# EAGLE design dpi rpi (EAGLE 8.3.2)
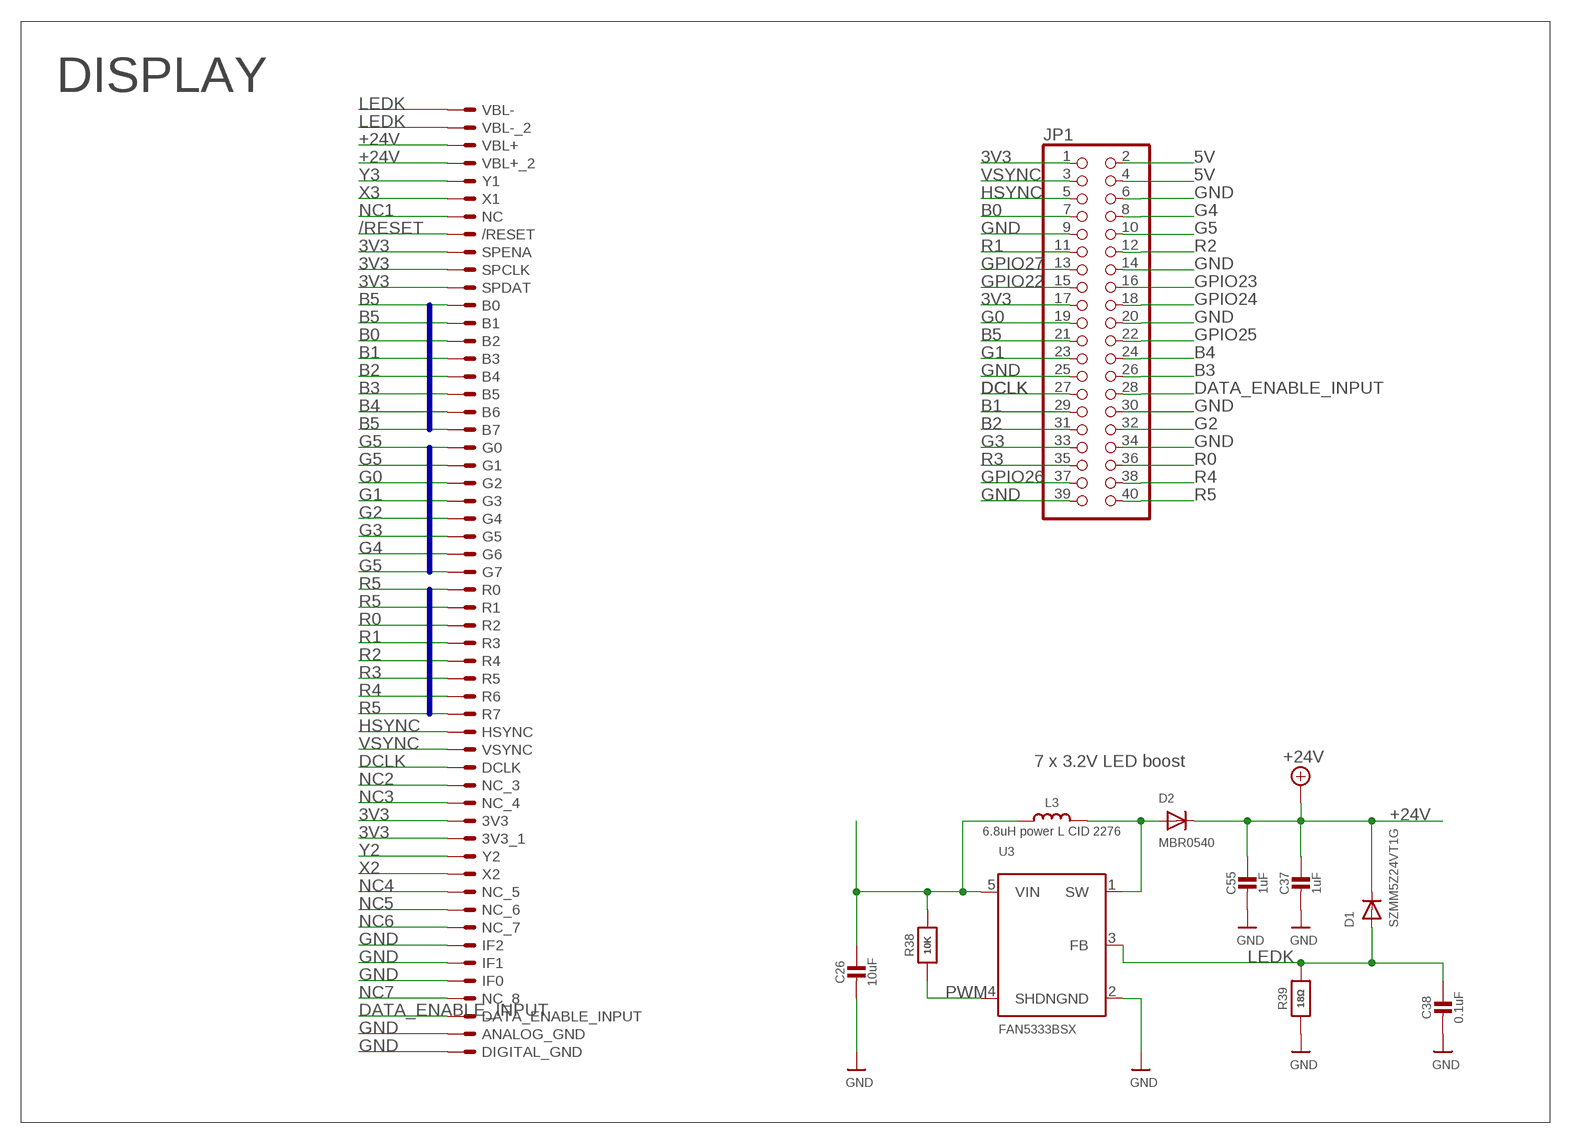
[diagram p0: schematic, sheet 1]

## Parts
C26  10uF  CAP_CERAMIC_0805MP  [_0805MP]
C37  1uF  CAP_CERAMIC_0805MP  [_0805MP]
C38  0.1uF  CAP_CERAMIC_0805MP  [_0805MP]
C55  1uF  CAP_CERAMIC_0805MP  [_0805MP]
D1  SZMM5Z24VT1G  DIODESMA  [SMADIODE]
D2  MBR0540  DIODESOD-123  [SOD-123]
JP1  PINHD-2X20  [2X20]
L3  6.8uH power L CID 2276  INDUCTORNR5040  [INDUCTOR_5X5MM_NR5040_NOTHERMALS]
R38  10K  RESISTOR_0805MP  [_0805MP]
R39  18Ω  RESISTOR_0805MP  [_0805MP]
U3  FAN5333BSX  FAN5331  [SOT23-5@1]
U$5  51296-5494  [51296]

## Nets
3V3: C26.1 JP1.1 JP1.17 L3.P$1 R38.2 U3.5(VIN) U$5.9(SPENA) U$5.10(SPCLK) U$5.11(SPDAT) U$5.41(3V3) U$5.42(3V3_1)
5V: JP1.2 JP1.4
+24V: C37.1 C55.1 D1.C D2.C U$5.3(VBL+) U$5.4(VBL+_2)
/RESET: U$5.8(/RESET)
B0: JP1.7 U$5.14(B2)
B1: JP1.29 U$5.15(B3)
B2: JP1.31 U$5.16(B4)
B3: JP1.26 U$5.17(B5)
B4: JP1.24 U$5.18(B6)
B5: JP1.21 U$5.12(B0) U$5.13(B1) U$5.19(B7)
DATA_ENABLE_INPUT: JP1.28 U$5.52(DATA_ENABLE_INPUT)
DCLK: JP1.27 U$5.38(DCLK)
G0: JP1.19 U$5.22(G2)
G1: JP1.23 U$5.23(G3)
G2: JP1.32 U$5.24(G4)
G3: JP1.33 U$5.25(G5)
G4: JP1.8 U$5.26(G6)
G5: JP1.10 U$5.20(G0) U$5.21(G1) U$5.27(G7)
GND: C26.2 C37.2 C38.2 C55.2 JP1.6 JP1.9 JP1.14 JP1.20 JP1.25 JP1.30 JP1.34 JP1.39 R39.1 U3.2(GND) U$5.48(IF2) U$5.49(IF1) U$5.50(IF0) U$5.53(ANALOG_GND) U$5.54(DIGITAL_GND)
GPIO22: JP1.15
GPIO23: JP1.16
GPIO24: JP1.18
GPIO25: JP1.22
GPIO26: JP1.37
GPIO27: JP1.13
HSYNC: JP1.5 U$5.36(HSYNC)
LEDK: C38.1 D1.A R39.2 U3.3(FB) U$5.1(VBL-) U$5.2(VBL-_2)
N$12: D2.A L3.P$2 U3.1(SW)
NC1: U$5.7(NC)
NC2: U$5.39(NC_3)
NC3: U$5.40(NC_4)
NC4: U$5.45(NC_5)
NC5: U$5.46(NC_6)
NC6: U$5.47(NC_7)
NC7: U$5.51(NC_8)
PWM: R38.1 U3.4(SHDN)
R0: JP1.36 U$5.30(R2)
R1: JP1.11 U$5.31(R3)
R2: JP1.12 U$5.32(R4)
R3: JP1.35 U$5.33(R5)
R4: JP1.38 U$5.34(R6)
R5: JP1.40 U$5.28(R0) U$5.29(R1) U$5.35(R7)
VSYNC: JP1.3 U$5.37(VSYNC)
X2: U$5.44(X2)
X3: U$5.6(X1)
Y2: U$5.43(Y2)
Y3: U$5.5(Y1)

## Buses
B0-B7
G0-G7
R0-R7

## Notes on the sheet
- DISPLAY
- 7 x 3.2V LED boost

## Library data of the parts
C26 C37 C38 C55 = microbuilder:CAP_CERAMIC: Ceramic Capacitors For new designs, use the packages preceded by an '_' character since they are more reliable: The following footprints should be used on most boards: _0402 - Standard footprint for regular board layouts _0603 - Standard footprint for regular board layouts _0805 - Standard footprint for regular board layouts _1206 - Standard footprint for regular board layouts For extremely tight-pitch boards where space is at a premium, the following 'micro-pitch' footprints can be used (smaller pads, no silkscreen outline, etc.): _0402MP - Micro-pitch footprint for very dense/compact boards _0603MP - Micro-pitch footprint for very dense/compact boards _0805MP - Micro-pitch footprint for very dense/compact boards _1206MP - Micro-pitch footprint for very dense/compact boards
D1 D2 = microbuilder:DIODE: Diode SMA Model Volts Amps Type Vf Vr Digikey # Notes SSA34-E3 40V 3A Schottky 480mV @ 3A 200uA @ 40V SSA34-E3/61TGITR-ND CDBA120-G 20V 1A Schottky 500mV @ 1A 500uA @ 20V 641-1014-6-ND REEL MBRA210 10V 2A Schottky 350mV @ 2A 700uA @ 10V MBRA210LT3 SOD-123 Model Volts Amps Type Vf Vr Order # Notes BAT54T1G 30V 200mA Schottky 800mV @ 200mA 2uA @ 25V BAT54T1GOSTR-ND B0530W 30V 500mA Schottky 430mV @ 500mA 130uA @ 30V B0530W-FDICT-ND REEL MBR120 20V 1A Schottky 340mV @ 1A MBR120VLSFT1GOSCT-ND SOD-323 Model Volts Amps Type Vf Vr Order # Notes PMEG2005EJ 20V 500mA Schottky 355mV @ 500mA 568-4110-1-ND ZLLS410 10V 570mA Schottky 380mV @ 570mA ZLLS410CT-ND 1N4148WS 75V 150mA Silicon/Simple 1V 1N4148WSFSCT-ND REEL SOD-523 Model Volts Amps Type Vf Vr Order # Notes BAT54XV2 30V 200mA Schottky 0.8V @ 100mA BAT54XV2CT-ND TB751S 30V 30mA Schottky RB751S-40TE61CT-ND SOT23-R/W (R = Solder Paste/Reflow Ovens, W = Hand-Soldering) Model Volts Amps Type Vf Vr Order # Notes BAT54FILM 40V 300mA Schottky 497-7162-1-ND
JP1 = adafruit:PINHD-2X20: PIN HEADER
L3 = microbuilder:INDUCTOR: Inductors 0603: 10nH Ceramic Inductor - microwire antenna/RF (Digikey: 712-1434-2-ND) 0805: 560nH Ceramic Inductor - RF (Digikey: 553-1047-1-ND) 270nH Ceramic Inductor - Q = 40@250MHz, +-5%, 1 Ohm DC Resistance (Digikey: 535-10506-2-ND) 1007 (2518 Metric) SMT: 10µH 10% 250mOhm 820mA 1007 Inductor (Digikey: 587-2189-1-ND) 22µH 10% 500mOhm 580mA 1007 Inductor (Digikey: 587-2190-1-ND) 47µH 10% 950mOhm 420mA 1007 Inductor (Digikey: 587-2191-1-ND) 47µH 5% 100mOhm 1A 1008 Inductor (Digikey: 732-1816-1-ND) 5.0x5.0mm (Taiyo Yuden NR5040 Series) 6.8µH 20% 2.3A 64mOhm Inductor (Digikey: 587-2374-2-ND) 5.0x5.0mm (TDK VLC5045 Series) 4.7µH 20% 3.3A 34mOhm Inductor (Digikey: 445-6526-1-ND) 6.8µH 20% 2.7A 46mOhm Inductor (Digikey: 445-6527-1-ND) 6.0x6.0mm (TDK VLC6045 Series) 4.7µH 20% 3.8A 27mOhm Inductor (Digikey: 445-6538-2-ND) 6.8µH 20% 3A 41mOhm Inductor (Digikey: 445-6540-1-ND) 6.2µH 30% 2.2A 45mOhm Inductor (Digikey: SRR5028-6R2YCT-ND) - Not TDK VLC6045 but footprint should match 6.0x6.0mm (TDK SLF6045 Series) 6.8uH 30% 2A 33mOhm Inductor (Digikey: 445-4572-1-ND, Mouser: 810-SLF645T6R8N2R0PF) 6.0x6.0mm (Sumida CDRH5D28 Series) 6.2uH 30% 1.8A 45mOhm Inductor (Digikey: 308-1542-1-ND) Taiyo Yuden NR3015T2R2M - 2.2uH 20% 1.5A (Digikey: 587-1648-2-ND, Mouser: 963-NR3015T2R2M) - Used with TI TPS62172 CoilCraft RFID Transponder Coil - MA5532-AE (For use with AS3935 Lightning Sensor) Vishay IHLP 1.0uH Molded Inductor - 24mOhm DCR, 5A, +/-20%, -55°C-125°C (Digikey: 541-1319-1-ND)
R38 R39 = microbuilder:RESISTOR: Resistors For new designs, use the packages preceded by an '_' character since they are more reliable: The following footprints should be used on most boards: _0402 - Standard footprint for regular board layouts _0603 - Standard footprint for regular board layouts _0805 - Standard footprint for regular board layouts _1206 - Standard footprint for regular board layouts For extremely tight-pitch boards where space is at a premium, the following 'micro-pitch' footprints can be used (smaller pads, no silkscreen outline, etc.): _0402MP - Micro-pitch footprint for very dense/compact boards _0603MP - Micro-pitch footprint for very dense/compact boards _0805MP - Micro-pitch footprint for very dense/compact boards _1206MP - Micro-pitch footprint for very dense/compact boards
U3 = microbuilder:FAN5331: FAN5331 - LED/OLED 20V Boost Converter Digikey: FAN5331SXCT-ND
U$5 = 51296-5494:51296-5494: Molex 0.5mm Pitch, Bottom contacts, 54 positions; AVAILABILITY: Good; DESCRIPTION: Conn.%3B Rect/PCB%3B FFC/FPC%3B 54 Cir.%3B SMT%3B ZIF%3B Rt. Angle%3B Easy-On Type%3B Gold Plate; MF: Molex; MP: 51296-5494; PACKAGE: None; PRICE: 1.58 USD

## Board
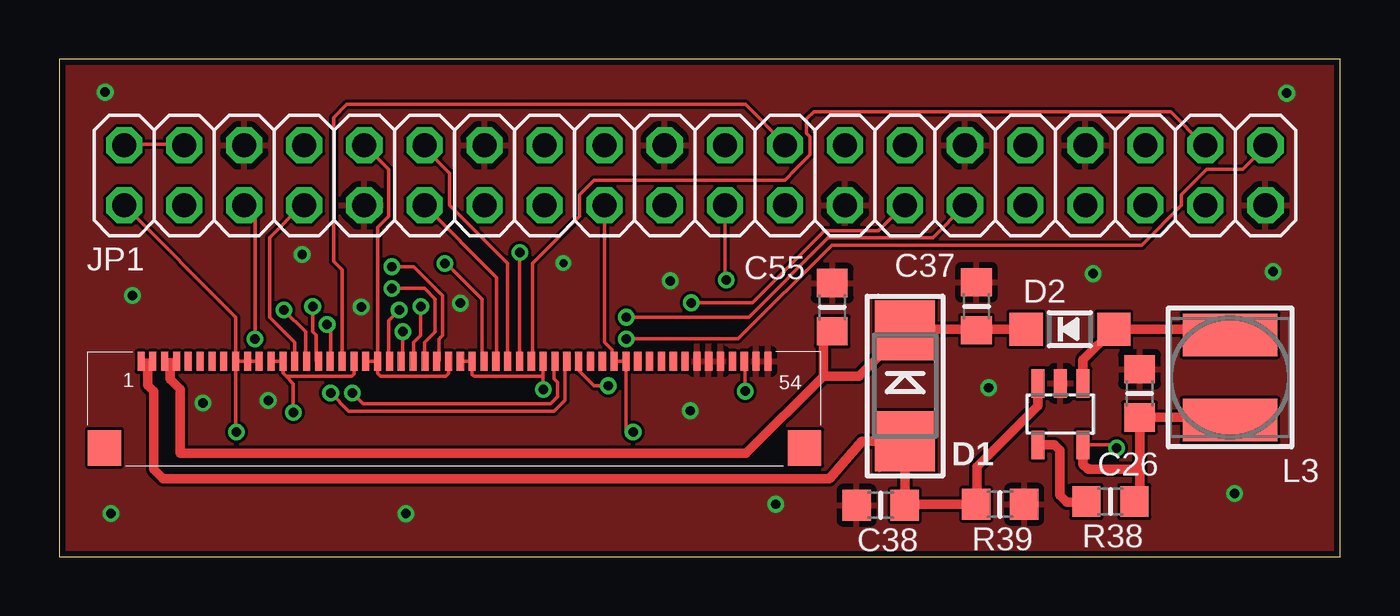
[diagram p1: board, top side]
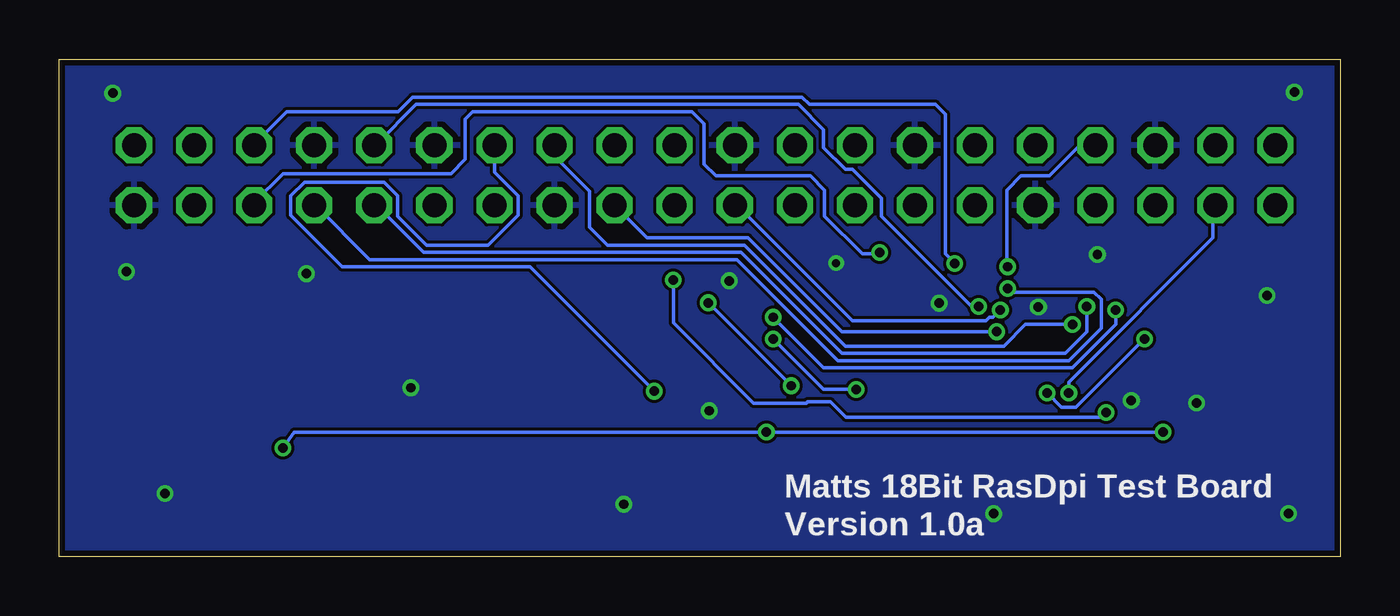
[diagram p2: board, bottom side, seen from below]

Size 54.17 x 21.03 mm. Coordinates in mm from the lower left corner, seen from the top.
Outline: 0,0 54.17,0 54.17,21.03 0,21.03 0,0
Copper layers (1*16): Top 0.035mm / dielectric 1.5mm / Bottom 0.035mm
Design rules "dirty_boards.v1": minimum track width 5mil, minimum drill 12mil, track to track 5mil, track to pad 5mil, pad to pad 5mil, via to via 5mil, smd to smd 0mil, copper to edge 10mil, drill to drill 10mil, minimum pad ring 10mil, minimum via ring 6mil, stop-mask expansion 2mil, vias tented up to drill 25mil, thermal gap 10mil

### Footprints (pad centres in the part's own frame; a part is rotated, then mirrored left to right if it is on the bottom)
_0805MP = smd 1.2 x 1.3: 1 -1.016,0; 2 1.016,0
SMADIODE = smd 2.54 x 2.54: A 2.349,0; C -2.349,0
SOD-123 = smd 1.4 x 1.4: A 1.85,0; C -1.85,0
2X20 = drill 1.016 octagon: 1 -24.13,-1.27; 2 -24.13,1.27; 3 -21.59,-1.27; 4 -21.59,1.27; 5 -19.05,-1.27; 6 -19.05,1.27; 7 -16.51,-1.27; 8 -16.51,1.27; 9 -13.97,-1.27; 10 -13.97,1.27; 11 -11.43,-1.27; 12 -11.43,1.27; 13 -8.89,-1.27; 14 -8.89,1.27; 15 -6.35,-1.27; 16 -6.35,1.27; 17 -3.81,-1.27; 18 -3.81,1.27; 19 -1.27,-1.27; 20 -1.27,1.27; 21 1.27,-1.27; 22 1.27,1.27; 23 3.81,-1.27; 24 3.81,1.27; 25 6.35,-1.27; 26 6.35,1.27; 27 8.89,-1.27; 28 8.89,1.27; 29 11.43,-1.27; 30 11.43,1.27; 31 13.97,-1.27; 32 13.97,1.27; 33 16.51,-1.27; 34 16.51,1.27; 35 19.05,-1.27; 36 19.05,1.27; 37 21.59,-1.27; 38 21.59,1.27; 39 24.13,-1.27; 40 24.13,1.27
INDUCTOR_5X5MM_NR5040_NOTHERMALS = smd 1.8 x 4: P$1 -1.8,0; P$2 1.8,0
SOT23-5@1 = smd 0.55 x 1.2: 1 -0.95,-1.3; 2 0,-1.3; 3 0.95,-1.3; 4 0.95,1.3; 5 -0.95,1.3
51296 = smd 0.3 x 0.8: 1 -13.25,2.3; 2 -12.75,2.3; 3 -12.25,2.3; 4 -11.75,2.3; 5 -11.25,2.3; 6 -10.75,2.3; 7 -10.25,2.3; 8 -9.75,2.3; 9 -9.25,2.3; 10 -8.75,2.3; 11 -8.25,2.3; 12 -7.75,2.3; 13 -7.25,2.3; 14 -6.75,2.3; 15 -6.25,2.3; 16 -5.75,2.3; 17 -5.25,2.3; 18 -4.75,2.3; 19 -4.25,2.3; 20 -3.75,2.3; 21 -3.25,2.3; 22 -2.75,2.3; 23 -2.25,2.3; 24 -1.75,2.3; 25 -1.25,2.3; 26 -0.75,2.3; 27 -0.25,2.3; 28 0.25,2.3; 29 0.75,2.3; 30 1.25,2.3; 31 1.75,2.3; 32 2.25,2.3; 33 2.75,2.3; 34 3.25,2.3; 35 3.75,2.3; 36 4.25,2.3; 37 4.75,2.3; 38 5.25,2.3; 39 5.75,2.3; 40 6.25,2.3; 41 6.75,2.3; 42 7.25,2.3; 43 7.75,2.3; 44 8.25,2.3; 45 8.75,2.3; 46 9.25,2.3; 47 9.75,2.3; 48 10.25,2.3; 49 10.75,2.3; 50 11.25,2.3; 51 11.75,2.3; 52 12.25,2.3; 53 12.75,2.3; 54 13.25,2.3 | smd 1.4 x 1.5: P$1 -14.8,-1.35; P$2 14.8,-1.35

### Placement (x,y rotation side)
C26  45.68,6.9 90 top
C37  38.78,10.58 90 top
C38  34.73,2.17 180 top
C55  32.68,10.54 90 top
D1  35.76,7.22 270 top
D2  42.73,9.61 0 top
JP1  26.87,16.11 0 top
L3  49.5,7.57 90 top
R38  44.44,2.33 0 top
R39  39.78,2.21 180 top
U3  42.33,6.02 180 top
U$5  16.71,5.95 0 top

### Tracks (layer width: path | path; a pad name or v marks a point on that pad's centre or on a via)
3V3  (via drill 0.4)
  Top 0.152: JP1.1 7.46,10.12 U$5.9 | U$5.9 U$5.10 U$5.11 | 48.99,5.23 49.22,5.19 L3.P$1 | U3.5 44.57,4.72 v44.7,4.59 | U$5.9 7.46,5.29 v7.49,5.27 | v24.26,5.27 23.96,5.37 U$5.42 U$5.41 23.37,8.29 23.37,8.75 23.06,9.05 JP1.17
  Top 0.406: 43.28,4.51 U3.5 43.28,3.91 43.5,3.69 45.64,3.69 45.68,3.74 | 48.99,5.23 48.34,5.89 C26.1 45.68,3.74 | 45.68,3.74 45.68,2.56 R38.2
  Bottom 0.152: v7.49,5.27 v24.26,5.27 44.23,5.27 v44.7,4.59
5V
  Top 0.152: JP1.2 2.79,17.43 5.23,17.43 JP1.4
+24V
  Top 0.152: D1.C C37.1 40.84,9.57 D2.C
  Top 0.254: 4.5,8.21 4.67,8.04 4.88,8.25 U$5.4 4.54,8.25 4.5,8.21 | 4.5,8.21 U$5.3
  Top 0.406: 32.3,7.62 33.82,7.62 D1.C 35.8,9.61 D2.C | 32.3,7.62 29.05,4.37 5.12,4.37 5.12,7.08 4.7,7.49 4.7,8.01 4.67,8.04 | 32.3,7.62 32.3,9.15 C55.1
B0
  Top 0.152: U$5.14 9.96,8.29 9.96,9.05 8.89,10.12 8.89,13.47 10.26,14.84 JP1.7
B1  (via drill 0.4)
  Top 0.152: v9.5,10.42 10.41,9.51 10.41,8.29 U$5.15 | v23.98,10.12 29.16,10.12 32.51,13.47 36.93,13.47 JP1.29
  Bottom 0.152: v9.5,10.42 9.5,9.81 11.33,7.98 21.84,7.98 v23.98,10.12
B2  (via drill 0.4)
  Top 0.152: v10.72,10.58 10.72,9.51 10.87,9.36 10.87,8.29 U$5.16
  Bottom 0.152: v10.72,10.58 10.72,9.51 11.63,8.59 21.08,8.59 25.35,12.86 38.76,12.86 40.74,14.84 JP1.31
B3  (via drill 0.4)
  Top 0.152: v11.33,9.81 11.48,9.66 11.48,8.29 U$5.17
  Bottom 0.152: v11.33,9.81 13.31,9.81 14.22,8.9 20.93,8.9 25.2,13.17 30.99,13.17 31.75,13.93 31.75,15.45 33.12,16.82 33.12,17.28 JP1.26
B4
  Top 0.152: 11.94,8.29 U$5.18 11.96,12.13 11.6,12.49 11.6,18.56 12.15,19.11 29.01,19.11 30.68,17.43 JP1.24
B5  (via drill 0.4)
  Top 0.152: U$5.12 U$5.13 9.46,7.75 9.59,7.62 | U$5.19 12.46,7.73 12.36,7.62 9.59,7.62 | JP1.21 28.14,11.75 v28.2,11.69 | v9.9,6.09 9.9,7.31 9.59,7.62
  Bottom 0.152: v28.2,11.69 28.2,9.89 24.8,6.49 22.58,6.49 22.52,6.55 21.56,6.55 20.9,5.89 10.1,5.89 v9.9,6.09
DATA_ENABLE_INPUT  (via drill 0.4)
  Top 0.152: v29,6.99 29,8.21 U$5.52
  Bottom 0.152: v29,6.99 34.26,12.25 42.19,12.25 44.37,14.43 44.37,15.25 43.79,15.83 40.43,15.83 39.85,15.25 39.85,14.38 38.63,13.17 36.04,13.17 34.77,14.43 34.77,15.25 35.76,16.24 JP1.28
DCLK  (via drill 0.4)
  Top 0.152: v23.22,7.22 22.61,7.22 22,7.83 22,8.14 U$5.38 | v26.72,10.73 29.31,10.73 32.36,13.78 34.65,13.78 35.71,14.84 JP1.27
  Bottom 0.152: v26.72,10.73 v23.22,7.22
G0  (via drill 0.4)
  Top 0.152: v14.38,10.42 13.92,9.97 13.92,8.29 U$5.22
  Bottom 0.152: v14.38,10.42 14.68,10.12 14.83,10.12 14.99,9.97 20.63,9.97 25.5,14.84 JP1.19
G1  (via drill 0.4)
  Top 0.152: v14.53,9.51 14.53,8.29 U$5.23
  Bottom 0.152: v14.53,9.51 21.08,9.51 25.04,13.47 29.31,13.47 JP1.23
G2  (via drill 0.4)
  Top 0.152: v15.29,10.58 15.29,9.36 14.99,9.05 14.99,8.29 U$5.24
  Bottom 0.152: v15.29,10.58 15.6,10.58 19.41,14.39 19.41,15.15 20.63,16.37 20.93,16.37 21.84,17.28 21.84,18.04 22.91,19.11 39.07,19.11 40.74,17.43 JP1.32
G3  (via drill 0.4)
  Top 0.152: v14.07,11.34 15.44,11.34 15.9,10.88 15.9,9.51 15.44,9.05 15.44,8.29 U$5.25
  Bottom 0.152: v14.07,11.34 13.92,11.18 10.41,11.18 10.11,10.88 10.11,9.66 11.48,8.29 21.23,8.29 25.5,12.56 41.05,12.56 43.33,14.84 JP1.33
G4  (via drill 0.4)
  Top 0.152: v14.07,12.25 14.99,12.25 16.21,11.03 16.21,9.36 16.05,9.2 16.05,8.29 U$5.26
  Bottom 0.152: JP1.8 11.01,17.38 12.3,16.09 13.5,16.09 14.1,15.49 14.1,12.28 v14.07,12.25
G5
  Top 0.152: U$5.21 U$5.20 | U$5.27 16.46,7.76 16.33,7.62 13.58,7.62 13.46,7.74 U$5.21 | JP1.10 13.92,16.37 13.92,14.39 13.46,13.93 13.46,8.29 U$5.21
GND  (via drill 0.35, 0.4)
  Top 0.152: 29.46,8.29 U$5.53 29.46,8.29
  other vias: 10.27,12.77 21.32,12.4 8.84,6.6 6.08,6.5 26.68,6.17 25.84,11.66 16.96,10.71 12.77,10.55 3.1,11.04 1.95,19.63 51.9,19.59 51.33,12.04 43.71,11.96 49.69,2.67 30.29,2.21 14.66,1.81 2.2,1.82 39.3,7.14
  pour Bottom: -1.45,21.91 57.46,21.91 57.7,-2.61 -1.21,-2.61
  pour Top: -1.42,21.91 57.55,21.95 58.1,-2.61 -0.83,-2.56
GPIO22
  Top 0.152: 20.63,14.84 JP1.15
GPIO25
  Top 0.152: 28.09,17.43 JP1.22
HSYNC  (via drill 0.4)
  Top 0.152: v12.4,6.92 12.85,6.46 20.78,6.46 21.08,6.77 21.08,7.37 20.93,7.53 20.93,8.14 U$5.36 | v8.28,9.2 8.28,14.39 JP1.5
  Bottom 0.152: v12.4,6.92 11.79,6.31 11.18,6.31 v8.28,9.2
LEDK
  Top 0.152: 35.75,4.7 35.75,4.86 | C38.1 35.75,4.7 | 34.67,3.62 35.75,4.7
  Top 0.254: U$5.1 U$5.2 3.96,8.19 3.74,7.97 U$5.1
  Top 0.406: U3.3 41.38,6.37 38.8,3.79 38.8,2.15 R39.2 35.79,2.21 C38.1 35.75,4.86 D1.A 33.94,4.87 32.56,3.3 4.4,3.3 4,3.69 4,6.99 3.74,7.25 3.74,7.97
N$12
  Top 0.406: U3.1 43.28,8.31 D2.A 49.26,9.61 L3.P$2
PWM
  Top 0.406: 41.38,4.38 U3.4 42.07,4.72 42.3,4.49 42.3,2.59 42.6,2.29 43.39,2.29 R38.1
R0  (via drill 0.4)
  Top 0.152: U$5.30 17.88,8.29 17.88,10.88 16.37,12.39 v16.3,12.39
  Bottom 0.152: 20.5,19.11 22.45,19.11 22.76,19.41 39.22,19.41 39.83,18.8 44.55,18.8 45.92,17.43 JP1.36 | 20.5,19.11 20.32,19.11 | 20.5,19.11 17.12,19.11 16.7,18.69 16.7,12.79 v16.3,12.39
R1
  Top 0.152: JP1.11 18.49,11.79 18.49,8.29 U$5.31
R2
  Top 0.152: U$5.32 18.95,8.29 18.95,12.4 16.51,14.84 16.51,16.21 15.44,17.28 JP1.12
R3  (via drill 0.4)
  Top 0.152: 19.46,8.2 19.56,8.29 U$5.33 19.46,12.64 v19.48,12.86
  Bottom 0.152: JP1.35 45.92,14.97 44.7,16.19 37.6,16.19 37,16.79 37,18.49 36.69,18.8 27.42,18.8 26.9,18.29 26.9,16.59 26.4,16.09 22.4,16.09 21.8,15.49 21.8,14.39 20.2,12.79 19.55,12.79 v19.48,12.86
R4
  Top 0.152: U$5.34 20.02,8.29 20.02,12.4 22,14.39 22,15.3 22.61,15.91 30.68,15.91 31.14,16.37 31.75,16.98 31.75,17.74 31.6,17.89 31.6,18.5 31.9,18.8 46.99,18.8 48.36,17.43 JP1.38
R5  (via drill 0.4)
  Top 0.152: U$5.28 U$5.29 17.47,7.69 17.54,7.62 20.45,7.62 20.46,7.64 | v23.98,9.2 28.7,9.2 32.66,13.17 45.77,13.17 47.45,14.84 47.45,15.3 48.51,16.37 50.04,16.37 50.95,17.28 JP1.40 | v20.47,7.07 v20.46,7.08 20.46,7.64 | 20.46,7.64 U$5.35
  Bottom 0.152: v20.47,7.07 21.84,7.07 v23.98,9.2
VSYNC  (via drill 0.4)
  Top 0.152: v11.48,6.92 12.24,6.16 20.93,6.16 21.39,6.61 21.39,8.14 U$5.37
  Bottom 0.152: v11.48,6.92 11.48,7.37 5.39,13.47 5.39,14.84 JP1.3

### Text on the board
bPlace: Matts 18Bit RasDpi Test Board | Version 1.0a